# Altium schematic sheet Main.SchDoc
size B
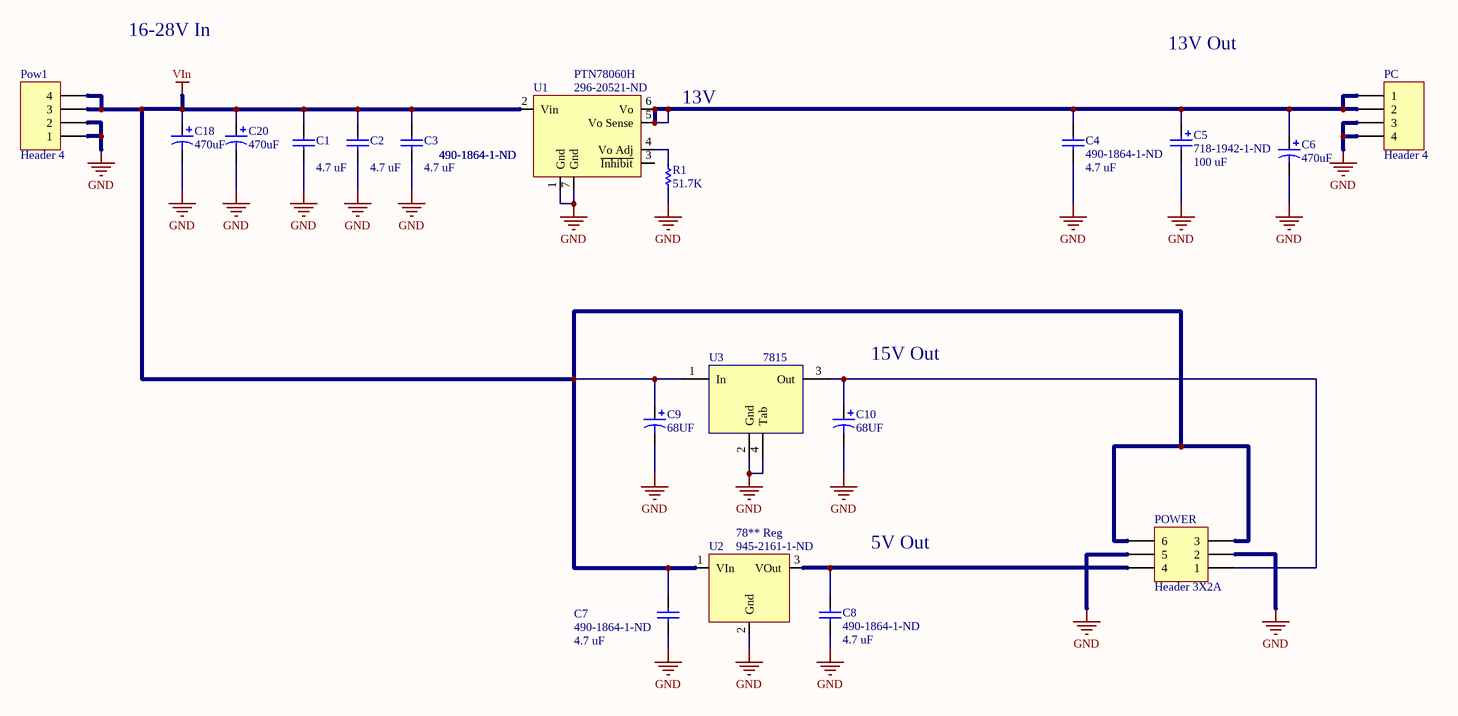
[diagram p0: Main.SchDoc]

## Parts
C1  490-1864-1-ND  value 4.7 uF  [1210C]
C2  490-1864-1-ND  value 4.7 uF  [1210C]
C3  490-1864-1-ND  value 4.7 uF  [1210C]
C4  490-1864-1-ND  value 4.7 uF  [1210C]
C5  718-1942-1-ND  value 100 uF  [F]
C6  value 470uF  [CAPPR7.5-16x35]  (hidden comment: Cap Pol1)
C7  490-1864-1-ND  value 4.7 uF  [1210C]
C8  490-1864-1-ND  value 4.7 uF  [1210C]
C9  value 68UF  [V]  (hidden comment: Cap Pol3)
C10  value 68UF  [V]  (hidden comment: Cap Pol3)
C18  value 470uF  [CAPPR7.5-16x35]  (hidden comment: Cap Pol1)
C20  value 470uF  [CAPPR7.5-16x35]  (hidden comment: Cap Pol1)
PC  Header 4  [Molex Mini-Fit Jr 5569 - 4 Pin, RA, Flat]
Pow1  Header 4  [Molex Mini-Fit Jr 5569 - 4 Pin, RA]
POWER  Header 3X2A  [Molex Mini-Fit Jr 5569 - 6 Pin, RA]
R1  value 51.7K  [1206R]  (hidden comment: Res Semi Small)
U1  PTN78060H  DKPN: 296-20521-ND  [Ti Package EUC (R-PDSS-T7)]
U2  78** Reg  DKPN: 945-2161-1-ND  [R-78Txx-1.0/AC]
U3  7815  [TO-220 - Small Heatsink]

## Nets
GND: C1.1 C2.1 C3.1 C4.1 C5.2 C6.2 C7.1 C8.1 C9.2 C10.2 C18.2 C20.2 PC.3 PC.4 Pow1.1 Pow1.2 POWER.2 POWER.5 R1.1 U1.1(Gnd) U1.7(Gnd) U2.2(Gnd) U3.2(Gnd) U3.4(Tab)
VIn: C1.2 C2.2 C3.2 C7.2 C9.1 C18.1 C20.1 Pow1.3 Pow1.4 POWER.3 POWER.6 U1.2(Vin) U2.1(VIn) U3.1(In)
NetC4_2: C4.2 C5.1 C6.1 PC.1 PC.2 U1.5(Vo_Sense) U1.6(Vo)
NetC8_2: C8.2 POWER.4 U2.3(VOut)
NetC10_1: C10.1 POWER.1 U3.3(Out)
NetR1_2: R1.2 U1.4(Vo_Adj)

Not connected (* = marked no-connect by the designer): U1 3(~{Inhibit})

## Notes on the sheet
- 16-28V In
- 13V
- 13V Out
- 15V Out
- 5V Out

## Library data of the parts
C1-C4 C7 C8 = Capacitor - SMT: SMT Capacitor; PackageReference: 1206C
C5 C6 C18 C20 = Cap Pol1: Polarized Capacitor (Radial); Published: 8-Jun-2000; LatestRevisionDate: 17-Jul-2002; LatestRevisionNote: Re-released for DXP Platform.; PackageReference: RB7.6-15; Publisher: Altium Limited
C9 C10 = Cap Pol3: KEMET T520 KO-CAP  Polymer SMT Tantalum; DKPN: 399-3330-1-ND; Voltage: 10V; Type: KEMET T520 KO-CAP  Polymer SMT Tantalum
PC Pow1 = Header 4: Header, 4-Pin; LatestRevisionDate: 17-Jul-2002; LatestRevisionNote: Re-released for DXP Platform.; Publisher: Altium Limited
POWER = Header 3X2A: Header, 3-Pin, Dual row; LatestRevisionDate: 17-Jul-2002; LatestRevisionNote: Re-released for DXP Platform.; Publisher: Altium Limited
R1 = Res Semi Small: Semiconductor Resistor; Published: 8-Jun-2000; LatestRevisionDate: 17-Jul-2002; LatestRevisionNote: Re-released for DXP Platform.; PackageReference: AXIAL-0.5; Publisher: Altium Limited
U1 = PTN78060H: 3-A, WIDE-INPUT ADJUSTABLE SWITCHING REGULATOR
U2 = 78** Voltage Regulator: 78** series Voltage Regulator
U3 = MIC2940: 1.2A Low-Dropout Voltage Regulator; DKPN: 576-1137-ND (5V TO-263); DKPN: 576-1136-ND (5V TO-220)